# EAGLE design RJ45LVDS_SPI (EAGLE 7.7.0)
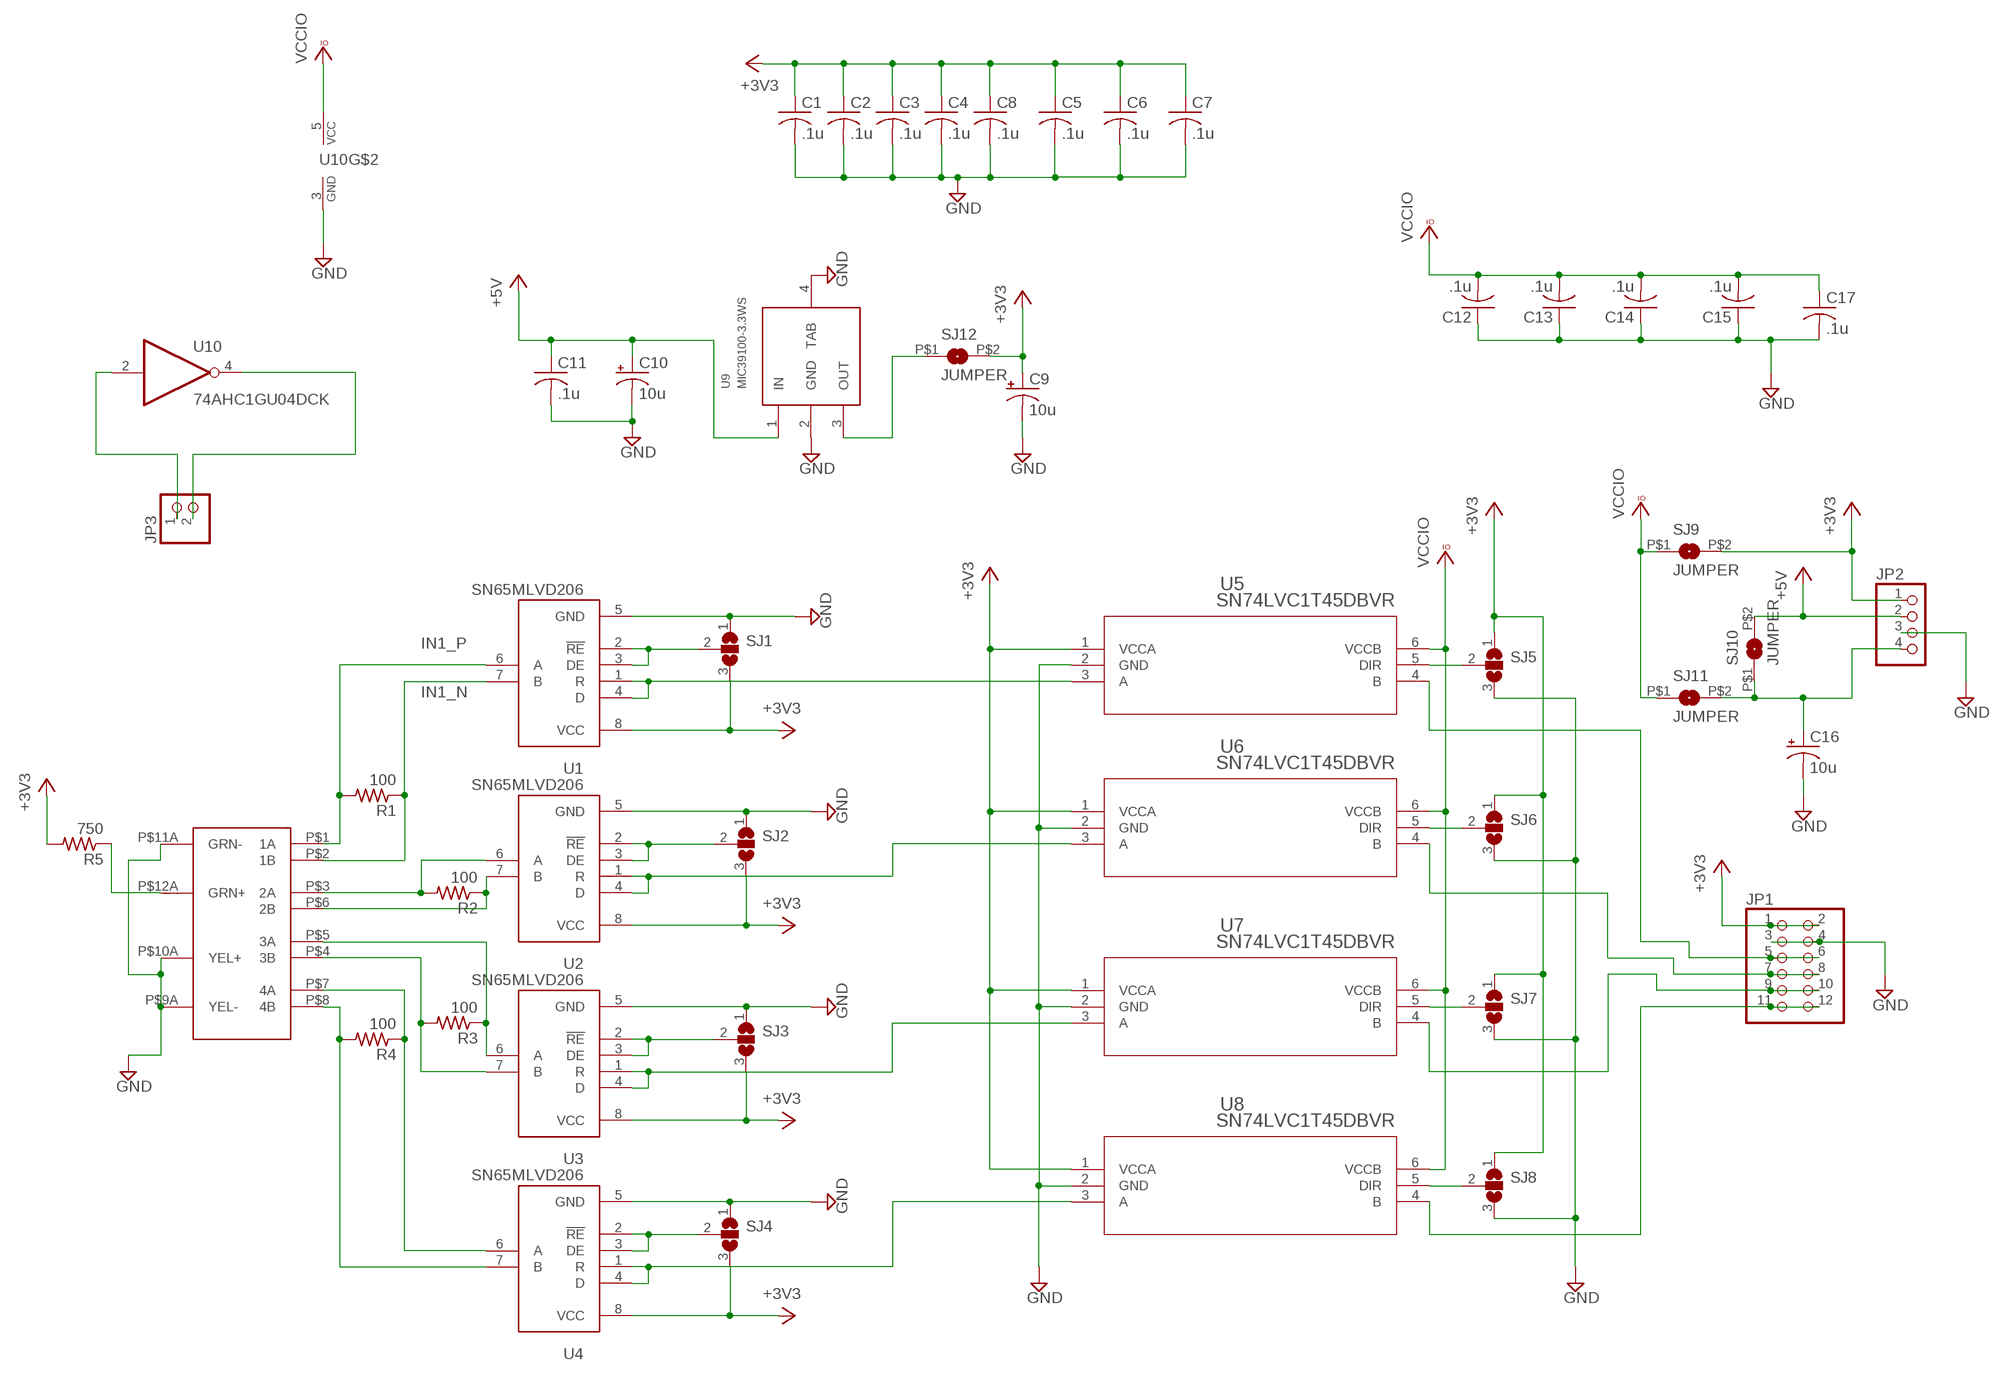
[diagram p0: schematic, sheet 1]

## Parts
C1  .1u  C-USC0603  [C0603]
C2  .1u  C-USC0603  [C0603]
C3  .1u  C-USC0603  [C0603]
C4  .1u  C-USC0603  [C0603]
C5  .1u  C-USC0603  [C0603]
C6  .1u  C-USC0603  [C0603]
C7  .1u  C-USC0603  [C0603]
C8  .1u  C-USC0603  [C0603]
C9  10u  CPOL-USSMCB  [SMC_B]
C10  10u  CPOL-USSMCB  [SMC_B]
C11  .1u  C-USC0603  [C0603]
C12  .1u  C-USC0603  [C0603]
C13  .1u  C-USC0603  [C0603]
C14  .1u  C-USC0603  [C0603]
C15  .1u  C-USC0603  [C0603]
C16  10u  CPOL-USSMCB  [SMC_B]
C17  .1u  C-USC0603  [C0603]
J1  MRJ  [MRJ-MEGAMIX]
JP1  PINHD-2X6  [2X06]
JP2  PINHD-1X4  [1X04]
JP3  PINHD-1X2  [1X02]
R1  100  R-US_R0603  [R0603]
R2  100  R-US_R0603  [R0603]
R3  100  R-US_R0603  [R0603]
R4  100  R-US_R0603  [R0603]
R5  750  R-US_R0603  [R0603]
SJ1  SJ2W  [SJ_2]
SJ2  SJ2W  [SJ_2]
SJ3  SJ2W  [SJ_2]
SJ4  SJ2W  [SJ_2]
SJ5  SJ2W  [SJ_2]
SJ6  SJ2W  [SJ_2]
SJ7  SJ2W  [SJ_2]
SJ8  SJ2W  [SJ_2]
SJ9  JUMPER  [0603JMP]
SJ10  JUMPER  [0603JMP]
SJ11  JUMPER  [0603JMP]
SJ12  JUMPER  [0603JMP]
U1  SN65MLVD206  [SOIC08-FAIRCHILD]
U2  SN65MLVD206  [SOIC08-FAIRCHILD]
U3  SN65MLVD206  [SOIC08-FAIRCHILD]
U4  SN65MLVD206  [SOIC08-FAIRCHILD]
U5  SN74LVC1T45DBVR  [DBV6]
U6  SN74LVC1T45DBVR  [DBV6]
U7  SN74LVC1T45DBVR  [DBV6]
U8  SN74LVC1T45DBVR  [DBV6]
U9  MIC39100-3.3WS  MIC37100  [SOT223]
U10  74AHC1GU04DCK  [SC70-5]

## Nets
1_33: U1.1(R) U1.4(D) U5.3(A)
2_33: U2.1(R) U2.4(D) U6.3(A)
3_33: U3.1(R) U3.4(D) U7.3(A)
4_33: U4.1(R) U4.4(D) U8.3(A)
+3V3: C1.1 C2.1 C3.1 C4.1 C5.1 C6.1 C7.1 C8.1 C9.+ JP1.1 JP1.2 JP2.1 R5.2 SJ1.3 SJ2.3 SJ3.3 SJ4.3 SJ5.1 SJ6.1 SJ7.1 SJ8.1 SJ9.P$2 SJ12.P$2 U1.8(VCC) U2.8(VCC) U3.8(VCC) U4.8(VCC) U5.1(VCCA) U6.1(VCCA) U7.1(VCCA) U8.1(VCCA)
+5V: C10.+ C11.1 JP2.2 SJ10.P$2 U9.1(IN)
A: JP3.1 U10.2(I)
GND: C1.2 C2.2 C3.2 C4.2 C5.2 C6.2 C7.2 C8.2 C9.- C10.- C11.2 C12.1 C13.1 C14.1 C15.1 C16.- C17.2 J1.P$9A(YEL-) J1.P$10A(YEL+) J1.P$11A(GRN-) JP1.3 JP1.4 JP2.3 SJ1.1 SJ2.1 SJ3.1 SJ4.1 SJ5.3 SJ6.3 SJ7.3 SJ8.3 U1.5(GND) U2.5(GND) U3.5(GND) U4.5(GND) U5.2(GND) U6.2(GND) U7.2(GND) U8.2(GND) U9.2(GND) U9.4(TAB) U10.3(GND)
IN1_N [lvds]: J1.P$2(1B) R1.1 U1.7(B)
IN1_P [lvds]: J1.P$1(1A) R1.2 U1.6(A)
IN2_N [lvds]: J1.P$6(2B) R2.1 U2.7(B)
IN2_P [lvds]: J1.P$3(2A) R2.2 U2.6(A)
IN3_N [lvds]: J1.P$4(3B) R3.2 U3.7(B)
IN3_P [lvds]: J1.P$5(3A) R3.1 U3.6(A)
IN4_N [lvds]: J1.P$8(4B) R4.2 U4.7(B)
IN4_P [lvds]: J1.P$7(4A) R4.1 U4.6(A)
N$3: SJ3.2 U3.2(!RE) U3.3(DE)
N$4: SJ2.2 U2.2(!RE) U2.3(DE)
N$5: SJ4.2 U4.2(!RE) U4.3(DE)
N$6: SJ1.2 U1.2(!RE) U1.3(DE)
N$7: SJ8.2 U8.5(DIR)
N$8: JP1.11 JP1.12 U8.4(B)
N$9: SJ5.2 U5.5(DIR)
N$10: SJ7.2 U7.5(DIR)
N$11: SJ6.2 U6.5(DIR)
N$13: JP1.5 JP1.6 U5.4(B)
N$14: JP1.7 JP1.8 U6.4(B)
N$15: JP1.9 JP1.10 U7.4(B)
N$16: C16.+ JP2.4 SJ10.P$1 SJ11.P$2
N$17: SJ12.P$1 U9.3(OUT)
N$19: J1.P$12A(GRN+) R5.1
NOT_A: JP3.2 U10.4(O)
VCCIO: C12.2 C13.2 C14.2 C15.2 C17.1 SJ9.P$1 SJ11.P$1 U5.6(VCCB) U6.6(VCCB) U7.6(VCCB) U8.6(VCCB) U10.5(VCC)

## Library data of the parts
C1-C8 C11-C15 C17 = rcl-dhs:C-US: CAPACITOR, American symbol
C9 C10 C16 = rcl:CPOL-US: POLARIZED CAPACITOR, American symbol
J1 = RJ45LVDS_SPI:MRJ
JP1 = pinhead:PINHD-2X6: PIN HEADER
JP2 = pinhead:PINHD-1X4: PIN HEADER
JP3 = pinhead:PINHD-1X2: PIN HEADER
R1-R5 = rcl-dhs:R-US_: RESISTOR, American symbol
SJ1-SJ8 = RJ45LVDS_SPI:SJ2W: SMD solder JUMPER
SJ9-SJ12 = rcl-dhs:JUMPER
U1-U4 = artiq-ttl:SN65MLVD206
U5-U8 = SN74LVC1T45DBVR:SN74LVC1T45DBVR; MANUFACTURER_PART_NUMBER: SN74LVC1T45DBVR; VENDOR: Texas Instruments
U9 = dds-boards:MIC37100
U10 = 74xx-little-us:74*1GU04: Single Unbuffered Inverter

## Net classes
1 lvds: width 0.305 mm, drill 0.356 mm, clearance 0.203 mm
2 cpwg: width 0.508 mm, clearance 0.305 mm

## Board
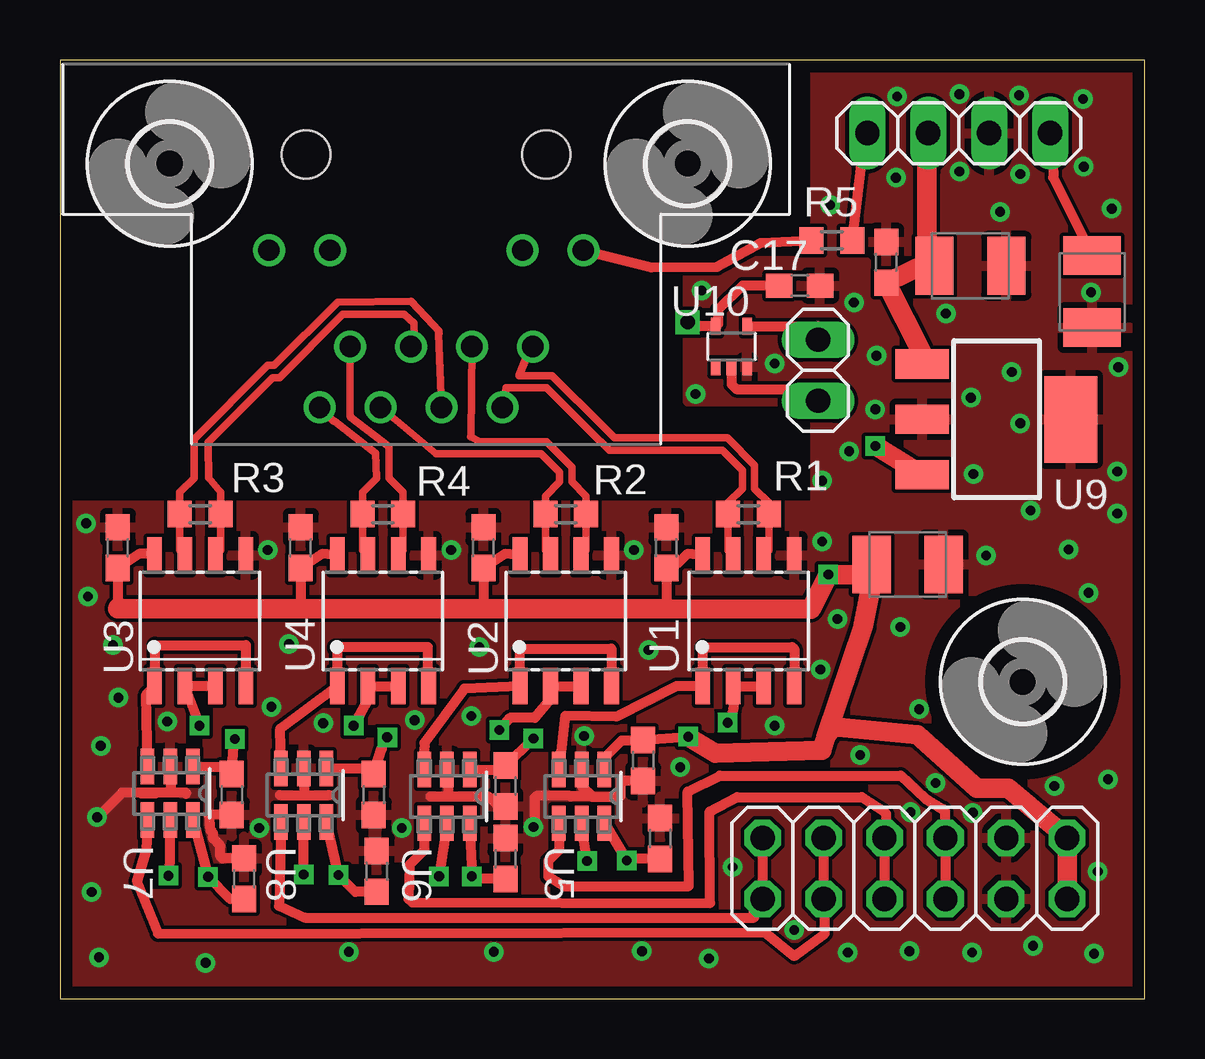
[diagram p1: board, top side]
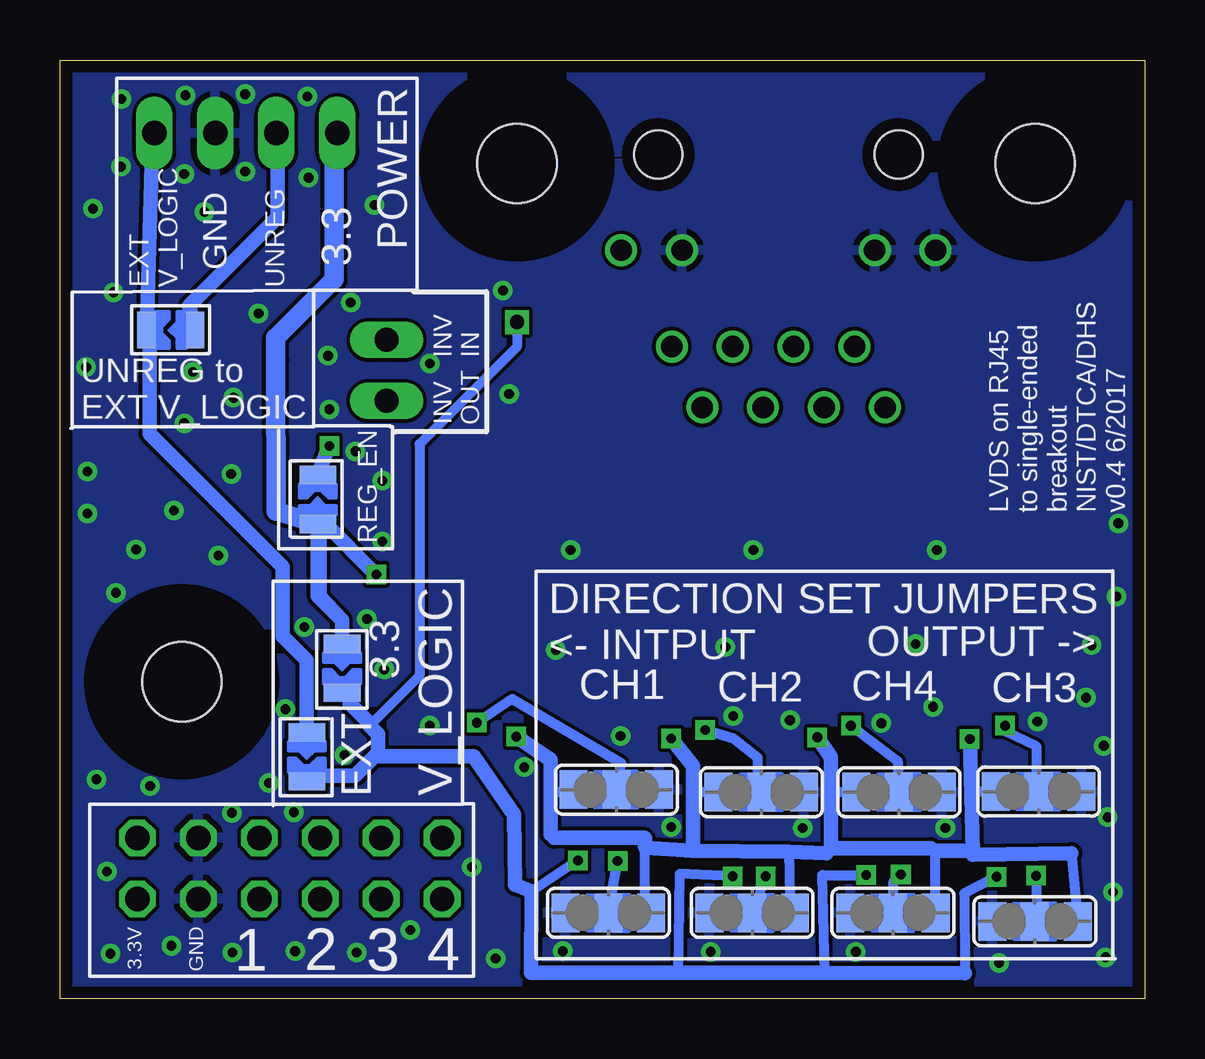
[diagram p2: board, bottom side, seen from below]

Size 45.21 x 39.12 mm. Coordinates in mm from the lower left corner, seen from the top.
Outline: 0,0 45.21,0 45.21,39.12 0,39.12 0,0
Copper layers (1*16): Top 0.0178mm / dielectric 59mil / Bottom 0.0178mm
Design rules "SSC-EAGLE-2Lyr_v1.0.0.3 *": minimum track width 6mil, minimum drill 14mil, track to track 6mil, track to pad 6mil, pad to pad 6mil, via to via 6mil, smd to smd 6mil, copper to edge 20mil, drill to drill 16mil, minimum pad ring 8mil, minimum via ring 8mil, stop-mask expansion 3mil, vias tented up to drill 17mil, thermal gap 10mil

### Footprints (pad centres in the part's own frame; a part is rotated, then mirrored left to right if it is on the bottom)
C0603 = smd 1.1 x 1: 1 -0.85,0; 2 0.85,0
SMC_B = smd 1.6 x 2.4: + -1.5,0; - 1.5,0
MRJ-MEGAMIX = drill 0.889: P$1 4.445,1.27; P$2 3.175,-1.27; P$3 1.905,1.27; P$4 0.635,-1.27; P$5 -0.635,1.27; P$6 -1.905,-1.27; P$7 -3.175,1.27; P$8 -4.445,-1.27; P$9A -6.553,5.283; P$10A -4.013,5.283; P$11A 4.013,5.283; P$12A 6.553,5.283 | hole 2.007: -5.004,9.271; 5.004,9.271
2X06 = drill 1.016 octagon: 1 -6.35,-1.27; 2 -6.35,1.27; 3 -3.81,-1.27; 4 -3.81,1.27; 5 -1.27,-1.27; 6 -1.27,1.27; 7 1.27,-1.27; 8 1.27,1.27; 9 3.81,-1.27; 10 3.81,1.27; 11 6.35,-1.27; 12 6.35,1.27
1X04 = drill 1.016 long: 1 -3.81,0; 2 -1.27,0; 3 1.27,0; 4 3.81,0
1X02 = drill 1.016 long: 1 -1.27,0; 2 1.27,0
R0603 = smd 1 x 1.1: 1 -0.85,0; 2 0.85,0
SJ_2 = smd 1.168 x 1.6: 1 -1.778,0; 2 0,0; 3 1.778,0
0603JMP = smd 0.762 x 1.524: P$1 -1.016,0; P$2 1.016,0
SOIC08-FAIRCHILD = smd 0.61 x 1.52: 1 -1.905,-2.723; 2 -0.635,-2.723; 3 0.635,-2.723; 4 1.905,-2.723; 5 1.905,2.723; 6 0.635,2.723; 7 -0.635,2.723; 8 -1.905,2.723
DBV6 = smd 1.473 x 0.559: 1 -1.118,0.95; 2 -1.118,0; 3 -1.118,-0.95; 4 1.118,-0.95; 5 1.118,0; 6 1.118,0.95
SOT223 = smd 1.219 x 2.235: 1 -2.311,-3.099; 2 0,-3.099; 3 2.311,-3.099 | smd 3.6 x 2.2: 4 0,3.099
SC70-5 = smd 0.4 x 0.7: 1 -0.65,-0.85; 2 0,-0.85; 3 0.65,-0.85; 4 0.65,0.85; 5 -0.65,0.85
3,3 = hole 3.3: 0,0

### Placement (x,y rotation side)
C1  25.27,18.8 90 top
C2  17.65,18.8 90 top
C3  2.41,18.8 90 top
C4  10.03,18.8 90 top
C5  24.31,9.93 270 top
C6  18.57,8.86 270 top
C7  7.16,8.51 270 top
C8  13.08,8.51 270 top
C9  35.33,18.1 0 top
C10  37.95,30.54 0 top
C11  34.44,30.68 90 top
C12  25.02,6.68 270 top
C13  18.57,5.84 270 top
C14  7.67,5 270 top
C15  13.21,5.31 270 top
C16  43.03,29.46 270 top
C17  30.84,29.72 0 top
J1  15.27,25.91 0 top
JP1  35.64,5.44 180 top
JP2  37.47,36.07 0 top
JP3  31.6,26.19 90 top
R1  28.7,20.19 0 top
R2  21.08,20.19 0 top
R3  5.84,20.19 180 top
R4  13.46,20.19 180 top
R5  32.18,31.6 0 top
SJ1  22.02,8.71 180 bottom
SJ2  15.98,8.61 180 bottom
SJ3  4.42,8.64 180 bottom
SJ4  10.24,8.61 180 bottom
SJ5  22.35,3.58 180 bottom
SJ6  16.36,3.58 180 bottom
SJ7  4.57,3.23 180 bottom
SJ8  10.49,3.58 180 bottom
SJ9  33.45,13.77 90 bottom
SJ10  40.59,27.86 0 bottom
SJ11  34.92,10.08 90 bottom
SJ12  34.47,20.8 270 bottom
U1  28.7,15.75 0 top
U2  21.08,15.75 0 top
U3  5.84,15.75 0 top
U4  13.46,15.75 0 top
U5  21.74,8.43 270 top
U6  16.13,8.43 270 top
U7  4.6,8.56 270 top
U8  10.16,8.48 270 top
U9  39.04,24.14 270 top
U10  27.99,27.18 0 top
U$1  [3,3]  4.57,34.8 0 top
U$2  [3,3]  40.13,13.21 0 top
U$3  [3,3]  26.16,34.8 0 top

### Tracks (layer width: path | path; a pad name or v marks a point on that pad's centre or on a via)
1_33
  Top 0.406: U5.3 20.8,10.04 20.88,10.29 21.06,11.79 23.19,11.76 25.7,13.03 U1.1 26.8,14.63 26.82,14.66 30.53,14.66 30.61,14.58 U1.4
2_33
  Top 0.406: U6.3 15.11,9.03 15.19,10.67 16.86,12.92 U2.1 19.18,14.55 19.2,14.58 22.96,14.58 22.99,14.61 U2.4
3_33
  Top 0.406: U3.4 7.75,14.73 3.96,14.73 3.96,13.03 U3.1 3.6,12.68 U7.3
4_33
  Top 0.406: U4.4 15.34,13.03 15.34,14.66 11.48,14.66 11.48,14.61 11.56,14.61 U4.1 9.19,11.26 U8.3
+3V3  (via drill 0.41)
  Top 0.406: 2.41,16.26 C3.1 3.3,18.54 3.81,18.54 U3.8 | 10.03,16.26 C4.1 10.92,18.54 U4.8 | U2.8 18.54,18.54 C2.1 17.65,16.26 | U1.8 26.16,18.54 25.78,18.16 25.49,18.16 C1.1 25.27,16.33 25.2,16.26 | 6.95,9.68 C7.1 | 12.91,9.6 C8.1 | 18.63,9.55 C6.1 | C7.1 7.26,10.79 v7.29,10.82 | C8.1 13.41,10.41 v13.64,10.9 | C6.1 v19.74,10.85 | v26.19,10.92 24.33,10.79 C5.1 24.3,10.77 23.42,10.77 22.69,10.04 U5.1 | R5.2 33.63,36.68 JP2.1 | 34.05,17.68 C9.+ 34.11,18.71 | U6.1 18.4,9.55 C6.1 | U8.1 12.84,9.6 C8.1 | U7.1 6.84,9.68 C7.1
  Top 0.813: 2.44,16.31 2.41,16.26 10.03,16.26 17.65,16.26 25.2,16.26 25.27,16.26 31.29,16.23 v32.03,17.68 34.05,17.68 | v26.19,10.92 27.33,10.24 31.75,10.36 31.93,10.91 | 31.93,10.91 33.47,15.47 34.11,18.71 | 31.93,10.91 32.25,11.33 35.74,11 38.23,8.76 39.52,8.76 JP1.1 JP1.2
  Bottom 0.406: 7.16,5.99 7.17,6.14 7.2,6.17 | 18.82,6.45 18.87,6.17 | v26.19,10.92 25.53,10.62 | 8.91,6.27 8.74,6.17 8.74,3.53 8.79,3.58 SJ8.1 | 20.83,6.68 20.85,6.71 | 24.61,6.71 24.77,6.86 | 20.83,6.33 20.8,6.3 20.8,6.33 20.85,6.38 20.85,3.28 SJ5.1 | 13.26,6.07 13.08,6.27 | SJ3.3 7.06,8.64 7.23,8.47 | SJ4.3 13.06,8.61 13.08,10.06 | SJ2.3 18.75,8.61 18.82,9.7 | SJ1.3 24.69,8.56 24.77,8.48 | 3.05,6.07 SJ7.1 | 14.83,6.12 14.76,3.3 SJ6.1 | 34.39,20.04 SJ12.P$2
  Bottom 0.61: v7.29,10.82 7.23,8.47 7.17,6.14 | 7.16,5.99 3.05,6.07 | v13.64,10.9 13.08,10.06 13.08,6.27 8.91,6.27 | v19.74,10.85 18.82,9.7 18.82,6.45 | 13.26,6.07 14.83,6.12 18.87,6.17 20.8,6.3 | 20.83,6.33 20.83,6.68 | 20.85,6.71 24.61,6.71 | 24.77,6.86 24.77,8.48 24.77,9.96 v26.19,10.92 | 8.74,6.17 7.2,6.17 | SJ9.P$2 33.45,15.77 | 33.45,15.77 34.39,16.76 34.39,20.04 | 33.45,15.77 34.47,16.79 34.47,19.76 34.34,19.89 34.24,19.89 v32.03,17.68
  Bottom 0.813: SJ12.P$2 36.2,20.32 36.22,26.62 36.22,27.53 33.78,29.97 33.78,35.94 JP2.1
+5V
  Top 0.406: 35.97,26.84 U9.1 | 36.19,30.7 C10.+ 36.14,31.78 | 36.14,36.22 JP2.2
  Top 0.813: 35.97,26.84 C11.1 36.19,30.7 | 36.14,31.78 36.14,34.49 36.14,36.22
  Bottom 0.406: 36.14,36.22 JP2.2
  Bottom 0.61: SJ10.P$2 39.83,28.88 36.14,32.56 36.14,36.22
A
  Top 0.406: U10.2 27.99,25.6 28.19,25.4 31.11,25.4 JP3.1
GND  (via drill 0.41)
  Top 0.406: C14.1 6.77,5.85 6.68,5.94 6.68,6.38 6.38,6.68 6.38,6.91 6.27,7.01 6.22,7.7 7.1,7.72 C7.2 | U5.2 21.74,8.87 22.17,8.43 | 22.17,8.43 21.29,8.43 21.26,8.46 19.86,8.46 19.79,8.38 19.79,7.21 19.76,7.19 | C5.2 23.41,9.08 23.37,9.12 23.37,8.46 23.32,8.41 22.2,8.41 22.17,8.43 | 5.26,8.53 5.26,8.59 2.59,8.59 1.6,7.59 | 9.17,8.48 11.2,8.48 | 15.44,8.43 16.2,8.43 | 16.2,8.43 17.86,8.43 18.21,8.08 | 16.2,8.43 16.2,8.94 16.18,8.97
  other vias: 38.61,18.47 31.78,19.05 32.11,33.07 42.04,18.72 42.88,16.92 16.31,18.69 8.66,18.69 30.61,2.87 33.1,29.01 31.7,13.72 19.74,7.16 34.9,37.59 40.56,2.21 43.1,1.88 18.08,1.96 6.07,1.5 28.04,5.49 21.84,10.95 32.89,22.81 37.97,25.04 38.02,1.93 12.04,1.96 35.41,1.98 38.05,7.75 43.26,5.31 10.97,11.48 1.32,4.45 2.44,12.55 42.98,29.44 36.93,28.55 33.35,10.16 24.26,1.98 1.63,1.73 25.86,9.65 33.99,24.56 40.46,20.35 34.04,26.8 37.49,34.47 36.5,8.99 40.03,23.98 34.85,34.21 41.45,8.86 32.41,15.82 17.48,14.66 14.25,7.11 9.55,14.78 4.47,11.56 1.55,7.57 39.67,26.11 17.14,11.79 37.49,37.69 40.03,34.37 42.65,37.49 14.78,11.61 2.21,14.73 8.81,12.17 29.79,11.38 35.03,15.49 39.98,37.64 8.31,7.11 32.84,1.93 39.19,32.79 24.54,14.53 23.93,18.69 1.7,10.54 1.09,19.81 27.05,1.68 43.69,9.14 38.07,21.87 35.46,7.77 44.07,21.97 42.67,34.67 44.12,26.31 43.84,32.92 35.81,12.06 44.07,20.22 1.17,16.76 26.75,29.51 26.49,25.2 29.79,26.47 31.78,21.59
  pour Bottom: 0,0 0,39.12 45.21,39.12 45.21,0
  pour Top: 0,0 0,20.57 31.5,20.57 31.5,39.12 45.21,39.12 45.21,0
  pour Top: 31.5,30.73 26.16,30.73 26.16,24.89 31.5,24.89
IN1_N
  Top 0.305: U1.7 27.85,18.69 R1.1 27.85,20.66 28.45,21.26 28.45,22.02 27.61,22.86 22.91,22.86 22.1,23.64 20.29,25.45 18.59,25.45 18.59,25.43 J1.P$2
IN1_P
  Top 0.305: U1.6 29.55,18.69 R1.2 29.55,20.66 28.96,21.26 28.96,22.23 27.82,23.37 23.12,23.37 22.63,23.85 20.5,25.96 19.13,25.96 19.61,27.18 J1.P$1 19.68,27.2
IN2_N
  Top 0.305: U2.7 20.23,18.69 R2.1 20.23,20.94 20.83,21.54 20.83,21.94 20.06,22.71 15.67,22.71 J1.P$6
IN2_P
  Top 0.305: U2.6 21.93,18.69 R2.2 21.93,20.94 21.34,21.54 21.34,22.15 20.27,23.22 17.5,23.22 17.12,23.42 17.14,23.44 J1.P$3
IN3_N
  Top 0.305: U3.7 4.99,18.69 R3.2 4.99,21.1 5.59,21.69 5.59,23.32 8.66,26.39 8.94,26.39 11.58,29.03 14.63,29.06 15.57,28.07 15.8,27.81 15.8,27.74 15.77,27.71 J1.P$4
IN3_P
  Top 0.305: U3.6 6.69,18.69 R3.1 6.69,21.1 6.2,21.72 6.17,23.03 6.17,23.19 8.87,25.88 9.15,25.88 11.79,28.52 14.35,28.52 14.76,28.14 14.78,27.23
  Top 0.406: 14.78,27.23 J1.P$5
IN4_N
  Top 0.305: U4.7 12.61,18.69 R4.2 12.61,21.1 13.21,21.69 13.16,22.74 11.46,24.06 11.4,24.06 J1.P$8
IN4_P
  Top 0.305: U4.6 14.31,18.69 R4.1 14.31,21.1 13.72,21.69 13.72,23.01 12.12,24.23 12.09,24.28 J1.P$7
N$3  (via drill 0.41)
  Top 0.406: U3.3 U3.2 v5.82,11.38
  Bottom 0.406: v5.82,11.38 5.82,11.18 4.52,10.54 4.52,8.74 SJ3.2
N$4  (via drill 0.41)
  Top 0.406: U2.3 U2.2 20.45,12.5 19.79,11.71 18.75,11.71 v18.31,11.2
  Bottom 0.406: v18.31,11.2 17.14,10.85 16.13,10.06 16.13,8.76 SJ2.2
N$5  (via drill 0.41)
  Top 0.406: U4.3 U4.2 12.83,12.45 v12.24,11.38
  Bottom 0.406: v12.24,11.38 10.29,9.91 10.29,8.66 SJ4.2
N$6  (via drill 0.41)
  Top 0.406: U1.3 U1.2 28.07,12.06 v27.84,11.51
  Bottom 0.406: v27.84,11.51 26.36,12.5 21.82,9.83 SJ1.2
N$7  (via drill 0.41)
  Top 0.406: v10.16,5.18 U8.5
  Bottom 0.406: SJ8.2 10.46,4.88 v10.16,5.18
N$8
  Top 0.406: U8.4 9.13,3.87 10.21,3.38 28.93,3.38 28.93,3.81 JP1.12 JP1.11
N$9  (via drill 0.41)
  Top 0.406: v21.97,5.74 U5.5
  Bottom 0.406: SJ5.2 v21.97,5.74
N$10  (via drill 0.41)
  Top 0.406: U7.5 4.55,5 v4.52,5.13
  Bottom 0.406: v4.52,5.13 4.5,3.3 SJ7.2
N$11  (via drill 0.41)
  Top 0.406: U6.5 v15.8,5.11
  Bottom 0.406: v15.8,5.11 SJ6.2
N$13
  Top 0.406: U5.4 20.79,6.19 20.34,5.74 20.34,5.11 21.01,4.7 26.21,4.7 26.16,8.64 27.51,9.3 35.05,9.3 36.04,8.36 36.8,7.9 36.91,7.8 JP1.5 JP1.6
N$14
  Top 0.406: U6.4 15.18,6.19 14.58,5.59 14.53,4.17 14.68,4.01 27.1,3.99 27.08,7.8 28.22,8.41 33.43,8.41 34.42,7.75 34.42,6.76 JP1.7 JP1.8
N$15
  Top 0.406: U7.4 3.6,6.21 3.2,4.9 4.09,2.72 29.39,2.77 30.61,1.78 31.88,2.72 31.88,4.12 JP1.10 JP1.9
N$16
  Top 0.406: C16.+ 41.4,34.21 41.38,34.87 JP2.4
  Bottom 0.406: 41.35,36.14 JP2.4 | 41.48,27.74 SJ10.P$1
  Bottom 0.61: SJ10.P$1 41.35,36.14 | SJ11.P$2 34.92,14.1 35.94,15.11 35.94,18.01 41.48,23.55 41.48,27.74
N$17  (via drill 0.41)
  Top 0.813: U9.3 v33.98,23.04
  Bottom 0.61: v33.98,23.04 SJ12.P$1
N$18
  Top 0.406: 10.19,9.2 10.19,8.51
N$19
  Top 0.406: J1.P$12A 24.65,30.48 27.39,30.5 29.21,31.5 R5.1
N$21
  Top 0.406: 4.6,9.3 4.62,9.3 4.62,8.64
N$23
  Top 0.406: 3.4,8.56 3.99,8.56
NOT_A
  Top 0.406: U10.4 31.6,28.03 JP3.2
VCCIO  (via drill 0.41, 0.6)
  Top 0.406: U7.6 v6.17,5.08 7.1,4.15 C14.2 | U8.6 v11.61,5.16 12.3,4.46 C15.2 | U6.6 v17.17,5.11 17.28,4.99 C13.2 | U5.6 v23.62,5.77 23.69,5.83 C12.2 | C17.1 28.45,29.72 27.43,28.7 27.43,28.12 U10.5 26.33,28.03 v26.16,28.19
  Bottom 0.406: v6.17,5.08 7.52,4.39 7.49,1.07 | 13.34,1.09 13.44,5.16 v11.61,5.16 | v17.17,5.11 19.38,5.21 19.46,1.09 | v23.62,5.77 25.55,4.47 | 31.96,10.26 31.88,10.11 | 32.33,11.4 32.33,11.51 | 33.15,12.32 33.15,12.7 SJ9.P$1 | v26.16,28.19 26.16,27.18 30.23,23.11 30.23,13.46 32.31,11.38 | 34.92,9.3 SJ11.P$1
  Bottom 0.61: 7.49,1.07 13.34,1.09 19.46,1.09 25.58,1.09 25.55,4.47 26.24,4.75 26.29,7.67 27.96,10.11 31.88,10.11 | 34.92,9.3 32.91,9.3 31.96,10.26 31.96,11.03 32.31,11.38 32.33,11.4 | 32.33,11.51 33.15,12.32

### Text on the board
bPlace: LVDS on RJ45 / to single-ended / breakout / NIST/DTCA/DHS / v0.4 6/2017
bNames: POWER | 3.3 | UNREG | GND | EXT / V_LOGIC | INV / IN | INV / OUT | UNREG to / EXT V_LOGIC | REG_EN | OUTPUT -> | DIRECTION SET JUMPERS / <- INTPUT | 3.3 | CH3 | CH4 | CH2 | CH1 | V_LOGIC | EXT | 4 | 3 | 2 | 1 | GND | 3.3V